# EAGLE design Project (EAGLE 9.6.2)
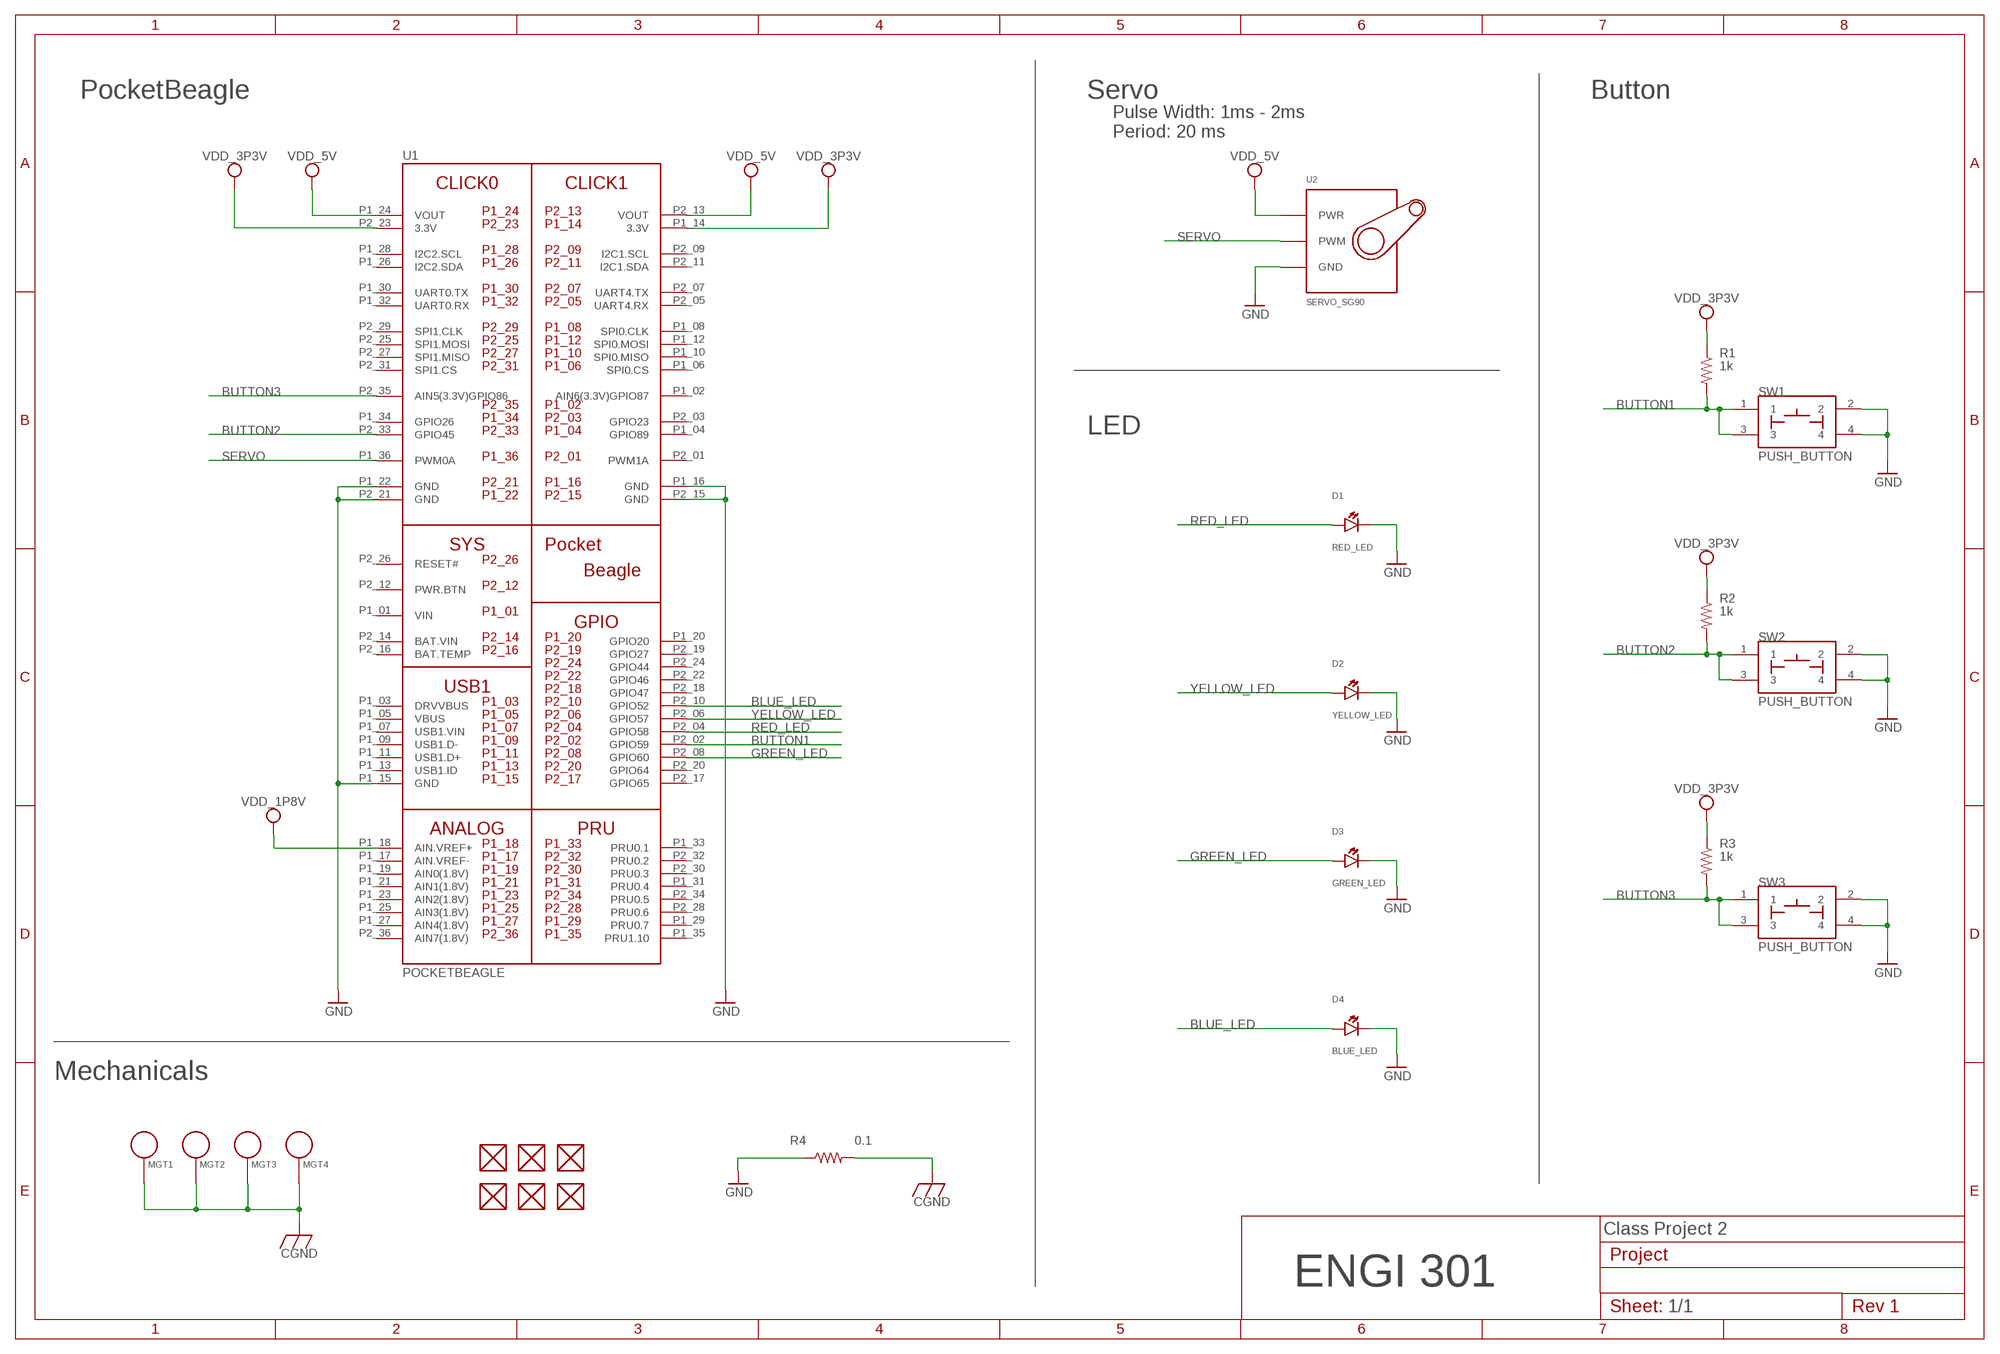
[diagram p0: schematic, sheet 1]

## Parts
D1  RED_LED  LED  [EIA-STD]
D2  YELLOW_LED  LED  [EIA-STD]
D3  GREEN_LED  LED  [EIA-STD]
D4  BLUE_LED  LED  [EIA-STD]
FUD1  FIDUCIAL  [FIDUCIAL_40MIL]
FUD2  FIDUCIAL  [FIDUCIAL_40MIL]
FUD3  FIDUCIAL  [FIDUCIAL_40MIL]
FUD4  FIDUCIAL  [FIDUCIAL_40MIL]
FUD5  FIDUCIAL  [FIDUCIAL_40MIL]
FUD6  FIDUCIAL  [FIDUCIAL_40MIL]
MGT1  MOUNTING_HOLE  [MOUNTING_HOLE]
MGT2  MOUNTING_HOLE  [MOUNTING_HOLE]
MGT3  MOUNTING_HOLE  [MOUNTING_HOLE]
MGT4  MOUNTING_HOLE  [MOUNTING_HOLE]
R1  1k  R_R0603  [R0603]
R2  1k  R_R0603  [R0603]
R3  1k  R_R0603  [R0603]
R4  0.1  R_R0805  [R0805]
SW1  PUSH_BUTTON  [BUTTON_12.5MM]
SW2  PUSH_BUTTON  [BUTTON_12.5MM]
SW3  PUSH_BUTTON  [BUTTON_12.5MM]
U1  POCKETBEAGLE  [POCKETBEAGLE]
U2  SERVO_SG90  [SERVO-X1]

## Nets
BLUE_LED: D4.ANODE U1.P2_10(GPIO52)
BUTTON1: R1.2 SW1.1 SW1.3 U1.P2_02(GPIO59)
BUTTON2: R2.2 SW2.1 SW2.3 U1.P2_33(GPIO45)
BUTTON3: R3.2 SW3.1 SW3.3 U1.P2_35(AIN5(3.3V)GPIO86)
CGND: MGT1.P$1 MGT2.P$1 MGT3.P$1 MGT4.P$1 R4.2
GND: D1.CATHODE D2.CATHODE D3.CATHODE D4.CATHODE R4.1 SW1.2 SW1.4 SW2.2 SW2.4 SW3.2 SW3.4 U1.P1_15(GND) U1.P1_16(GND) U1.P1_22(GND) U1.P2_15(GND) U1.P2_21(GND) U2.GND
GREEN_LED: D3.ANODE U1.P2_08(GPIO60)
RED_LED: D1.ANODE U1.P2_04(GPIO58)
SERVO: U1.P1_36(PWM0A) U2.SIG(PWM)
VDD_1P8V: U1.P1_18(AIN.VREF+)
VDD_3P3V: R1.1 R2.1 R3.1 U1.P1_14(3.3V) U1.P2_23(3.3V)
VDD_5V: U1.P1_24(VOUT) U1.P2_13(VOUT) U2.PWR
YELLOW_LED: D2.ANODE U1.P2_06(GPIO57)
Unconnected: FUD1.P$1 FUD2.P$1 FUD3.P$1 FUD4.P$1 FUD5.P$1 FUD6.P$1 U1.P1_02(AIN6(3.3V)GPIO87) U1.P1_03(DRVVBUS) U1.P1_04(GPIO89) U1.P1_05(VBUS) U1.P1_06(SPI0.CS) U1.P1_07(USB1.VIN) U1.P1_08(SPI0.CLK) U1.P1_09(USB1.D-) U1.P1_10(SPI0.MISO) U1.P1_11(USB1.D+) U1.P1_12(SPI0.MOSI) U1.P1_13(USB1.ID) U1.P1_17(AIN.VREF-) U1.P1_19(AIN0(1.8V)) U1.P1_20(GPIO20) U1.P1_21(AIN1(1.8V)) U1.P1_23(AIN2(1.8V)) U1.P1_25(AIN3(1.8V)) U1.P1_26(I2C2.SDA) U1.P1_27(AIN4(1.8V)) U1.P1_28(I2C2.SCL) U1.P1_29(PRU0.7) U1.P1_30(UART0.TX) U1.P1_31(PRU0.4) U1.P1_32(UART0.RX) U1.P1_33(PRU0.1) U1.P1_34(GPIO26) U1.P1_35(PRU1.10) U1.P2_01(PWM1A) U1.P2_03(GPIO23) U1.P2_05(UART4.RX) U1.P2_07(UART4.TX) U1.P2_09(I2C1.SCL) U1.P2_11(I2C1.SDA) U1.P2_12(PWR.BTN) U1.P2_16(BAT.TEMP) U1.P2_17(GPIO65) U1.P2_18(GPIO47) U1.P2_19(GPIO27) U1.P2_20(GPIO64) U1.P2_22(GPIO46) U1.P2_24(GPIO44) U1.P2_25(SPI1.MOSI) U1.P2_26(RESET#) U1.P2_27(SPI1.MISO) U1.P2_28(PRU0.6) U1.P2_29(SPI1.CLK) U1.P2_30(PRU0.3) U1.P2_31(SPI1.CS) U1.P2_32(PRU0.2) U1.P2_34(PRU0.5) U1.P2_36(AIN7(1.8V))

## Notes on the sheet
- PocketBeagle | Servo | Button
- Pulse Width: 1ms - 2ms
  Period: 20 ms
- LED
- Mechanicals
- Class Project 2
- ENGI 301
- 1/1

## Power pins joined to a net without a drawn wire
BAT.VIN: U1.P2_14(BAT.VIN)
VIN: U1.P1_01(VIN)

## Library data of the parts
D1-D4 = combo_lock:LED: EIA-STD LED, LTST-C191TBKT
FUD1-FUD6 = combo_lock:FIDUCIAL
MGT1-MGT4 = combo_lock:MOUNTING_HOLE: Chassis Mounting Hole w/GND connection ability
R1-R4 = combo_lock:R_: RESISTOR, American symbol
SW1-SW3 = combo_lock:PUSH_BUTTON
U1 = combo_lock:POCKETBEAGLE
U2 = combo_lock:SERVO_SG90

## Board
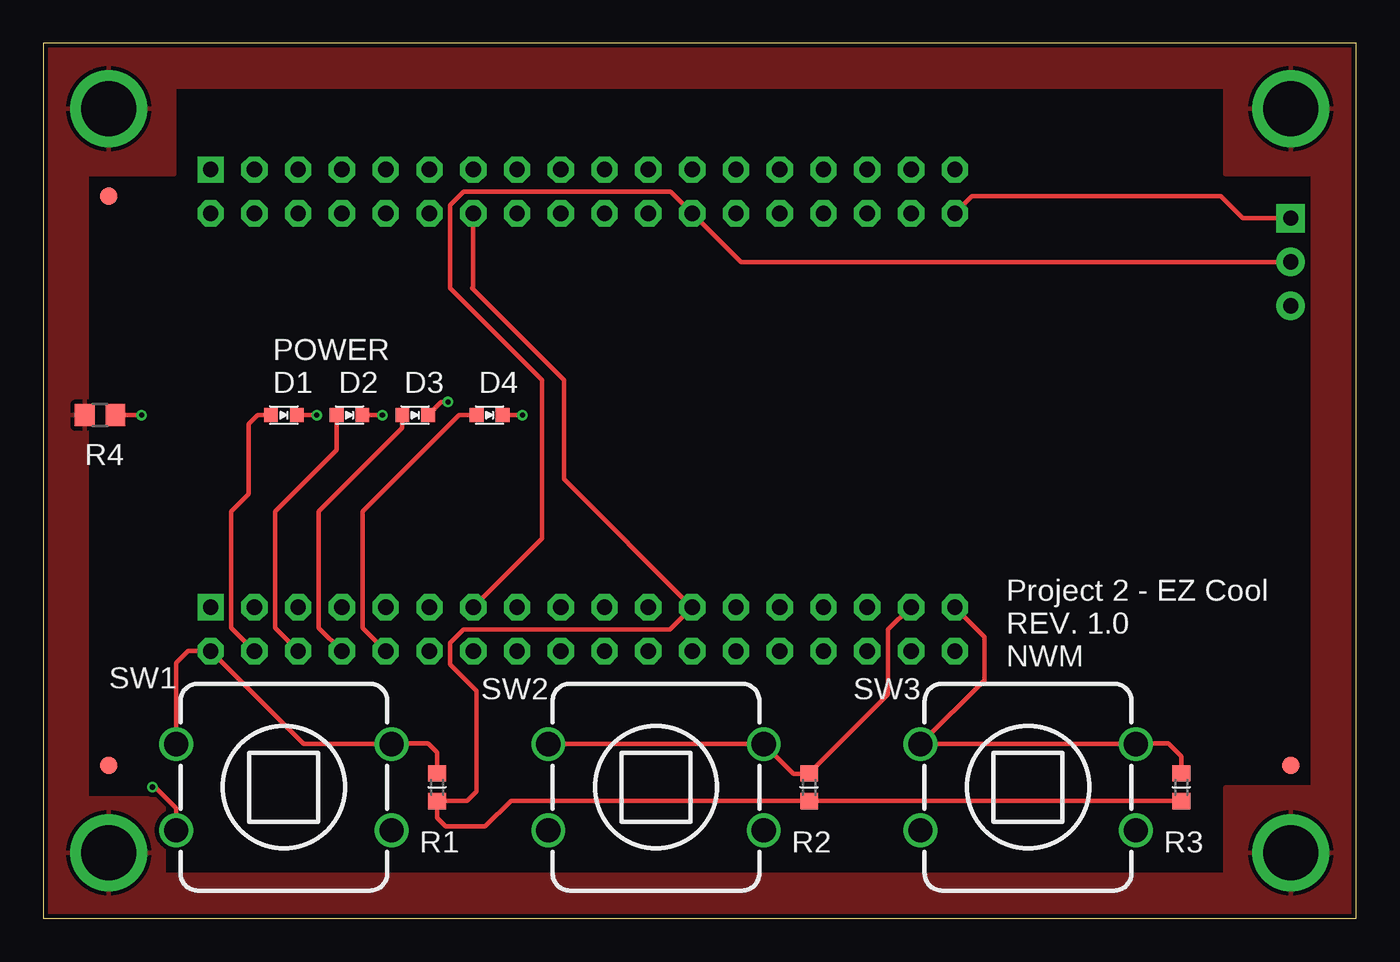
[diagram p1: board, top side]
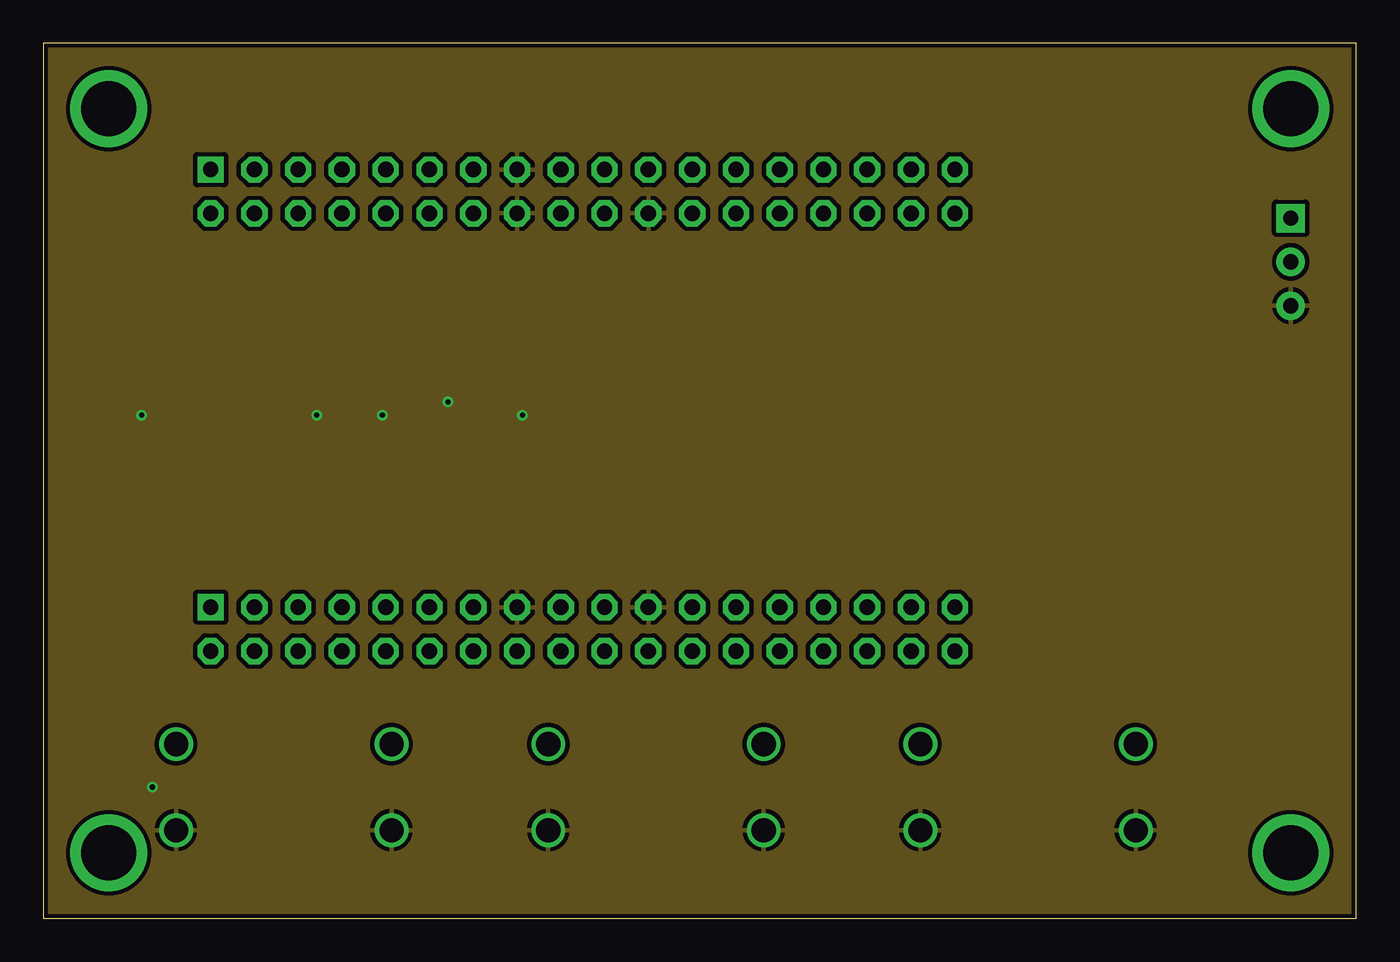
[diagram p2: board, inner layer Route2]
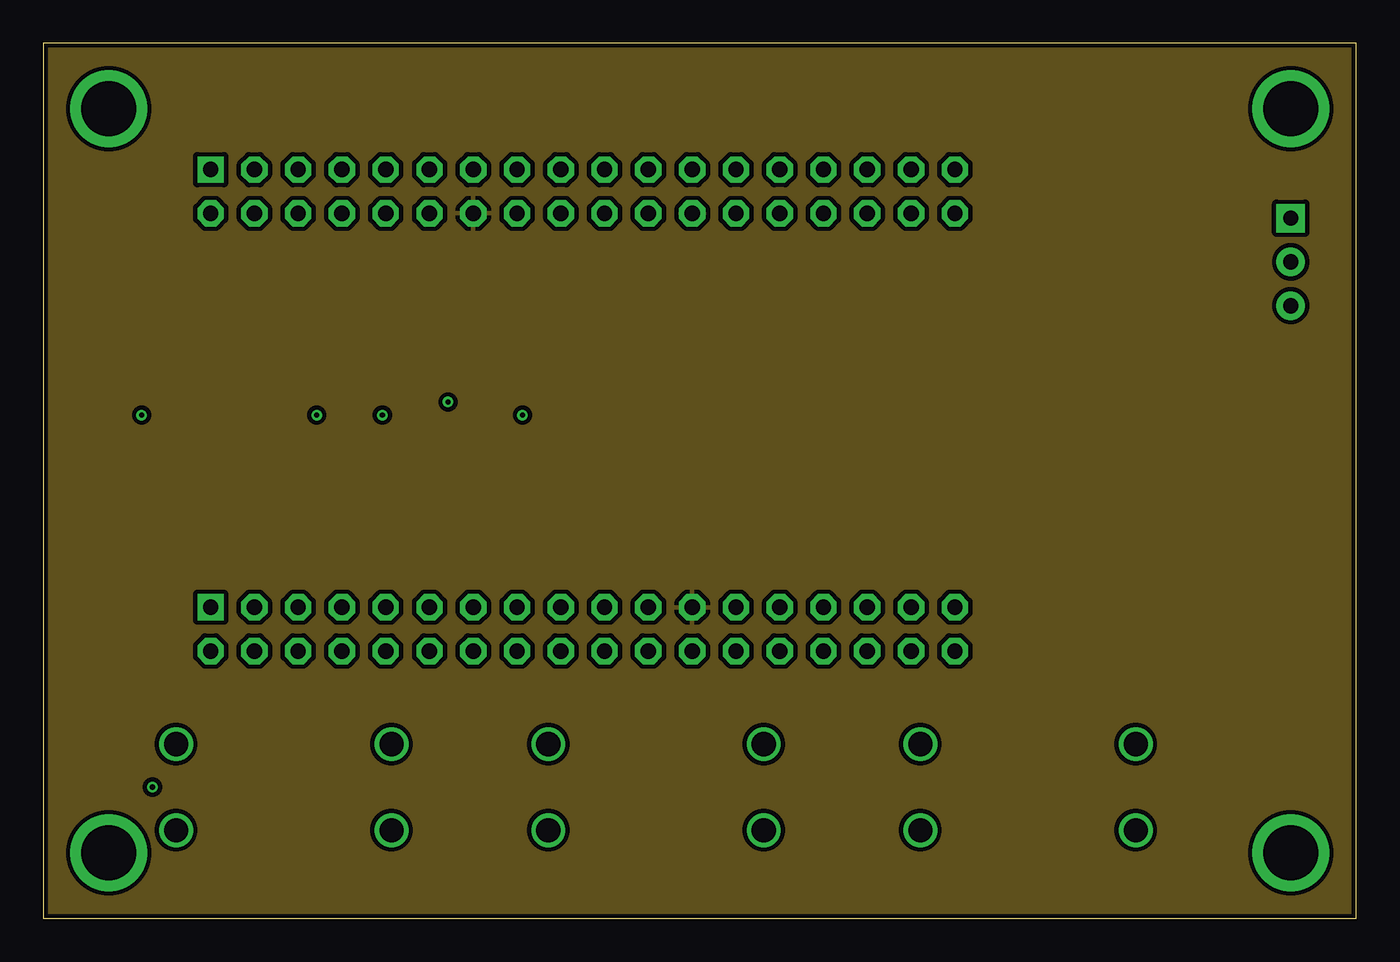
[diagram p3: board, inner layer Route15]
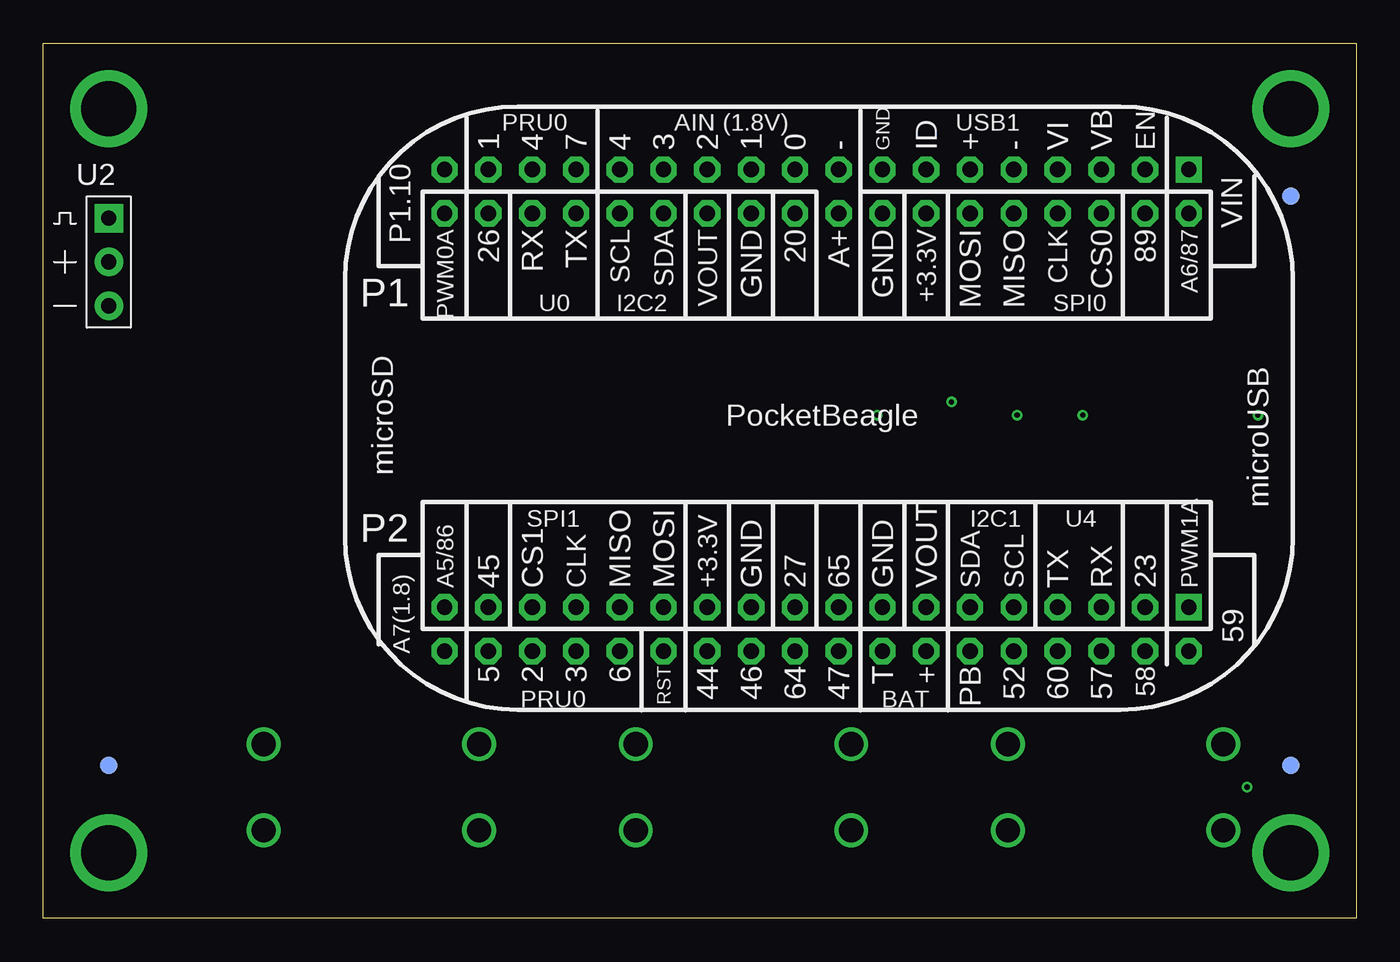
[diagram p4: board, bottom side, seen from below]

Size 76.2 x 50.8 mm. Coordinates in mm from the lower left corner, seen from the top.
Outline: 0,0 76.18,0 76.2,50.8 0,50.8 0,0
Copper layers (1*2*15*16): Top 0.035mm / dielectric 0.23mm / Route2 0.035mm / dielectric 0.93mm / Route15 0.035mm / dielectric 0.23mm / Bottom 0.035mm
Design rules "ENGI301_4lyr": minimum track width 10mil, minimum drill 12mil, track to track 10mil, track to pad 10mil, pad to pad 10mil, via to via 10mil, smd to smd 10mil, copper to edge 10mil, drill to drill 12mil, minimum pad ring 6mil, minimum via ring 6mil, stop-mask expansion 3mil, vias tented up to drill 25mil, thermal gap 10mil

### Footprints (pad centres in the part's own frame; a part is rotated, then mirrored left to right if it is on the bottom)
EIA-STD = smd 0.8 x 0.8: ANODE -0.75,0; CATHODE 0.75,0
FIDUCIAL_40MIL = smd 1.016 x 1.016: P$1 0,0
MOUNTING_HOLE = drill 3.175 pad 4.445: P$1 0,0
R0603 = smd 0.95 x 1.031: 1 -0.8,0; 2 0.8,0
R0805 = smd 1.143 x 1.27: 1 -0.889,0; 2 0.889,0
BUTTON_12.5MM = drill 1.4: 1 -6.25,2.5; 2 -6.25,-2.5; 3 6.25,2.5; 4 6.25,-2.5
POCKETBEAGLE = drill 0.889 pad 1.524 square: P1_01 5.91,3.53; P2_01 5.91,28.93 | drill 0.889 pad 1.524 octagon: P1_02 5.91,6.07; P1_03 8.45,3.53; P1_04 8.45,6.07; P1_05 10.99,3.53; P1_06 10.99,6.07; P1_07 13.53,3.53; P1_08 13.53,6.07; P1_09 16.07,3.53; P1_10 16.07,6.07; P1_11 18.61,3.53; P1_12 18.61,6.07; P1_13 21.15,3.53; P1_14 21.15,6.07; P1_15 23.69,3.53; P1_16 23.69,6.07; P1_17 26.23,3.53; P1_18 26.23,6.07; P1_19 28.77,3.53; P1_20 28.77,6.07; P1_21 31.31,3.53; P1_22 31.31,6.07; P1_23 33.85,3.53; P1_24 33.85,6.07; P1_25 36.39,3.53; P1_26 36.39,6.07; P1_27 38.93,3.53; P1_28 38.93,6.07; P1_29 41.47,3.53; P1_30 41.47,6.07; P1_31 44.01,3.53; P1_32 44.01,6.07; P1_33 46.55,3.53; P1_34 46.55,6.07; P1_35 49.09,3.53; P1_36 49.09,6.07; P2_02 5.91,31.47; P2_03 8.45,28.93; P2_04 8.45,31.47; P2_05 10.99,28.93; P2_06 10.99,31.47; P2_07 13.53,28.93; P2_08 13.53,31.47; P2_09 16.07,28.93; P2_10 16.07,31.47; P2_11 18.61,28.93; P2_12 18.61,31.47; P2_13 21.15,28.93; P2_14 21.15,31.47; P2_15 23.69,28.93; P2_16 23.69,31.47; P2_17 26.23,28.93; P2_18 26.23,31.47; P2_19 28.77,28.93; P2_20 28.77,31.47; P2_21 31.31,28.93; P2_22 31.31,31.47; P2_23 33.85,28.93; P2_24 33.85,31.47; P2_25 36.39,28.93; P2_26 36.39,31.47; P2_27 38.93,28.93; P2_28 38.93,31.47; P2_29 41.47,28.93; P2_30 41.47,31.47; P2_31 44.01,28.93; P2_32 44.01,31.47; P2_33 46.55,28.93; P2_34 46.55,31.47; P2_35 49.09,28.93; P2_36 49.09,31.47
SERVO-X1 = drill 0.889 pad 1.651: GND 0,-2.54; PWR 0,0 | drill 0.889 pad 1.651 square: SIG 0,2.54

### Placement (x,y rotation side)
D1  13.97,29.21 0 top
D2  17.78,29.21 0 top
D3  21.59,29.21 0 top
D4  25.91,29.21 0 top
FUD1  3.81,8.89 0 top
FUD2  3.81,41.91 0 top
FUD3  72.39,8.89 0 top
FUD4  3.81,8.89 0 bottom
FUD5  3.81,41.91 0 bottom
FUD6  72.39,8.89 0 bottom
MGT1  3.81,3.81 0 top
MGT2  72.39,3.81 0 top
MGT3  72.39,46.99 0 top
MGT4  3.81,46.99 0 top
R1  22.86,7.62 90 top
R2  44.45,7.62 90 top
R3  66.04,7.62 90 top
R4  3.3,29.21 180 top
SW1  13.97,7.62 0 top
SW2  35.56,7.62 0 top
SW3  57.15,7.62 0 top
U1  3.81,46.99 180 bottom
U2  72.39,38.1 0 bottom

### Tracks (layer width: path | path; a pad name or v marks a point on that pad's centre or on a via)
BLUE_LED
  Top 0.254: U1.P2_10 18.54,16.86 18.54,23.62 22.99,28.07 24.13,29.21 D4.ANODE
BUTTON1
  Top 0.254: R1.2 22.86,9.65 22.35,10.16 20.26,10.16 SW1.3 15.12,10.12 U1.P2_02 8.41,15.52 7.72,14.83 SW1.1
BUTTON2
  Top 0.254: U1.P2_33 50.32,18.06 49.02,16.76 49.02,12.99 R2.2 44.41,8.38 43.55,8.38 SW2.3 SW2.1
BUTTON3
  Top 0.254: R3.2 66.04,9.4 65.28,10.16 63.44,10.16 SW3.3 SW3.1 54.61,13.83 54.61,16.35 U1.P2_35
CGND
  pour Top: -1.27,25.4 -1.27,-1.27 77.47,-1.27 77.47,25.4 73.66,25.4 73.66,7.62 68.58,7.62 68.58,2.54 6.99,2.54 6.99,6.99 2.54,6.99 2.54,25.4
  pour Top: -1.27,25.4 -1.27,52.07 77.47,52.07 77.47,25.4 73.66,25.4 73.66,43.18 68.58,43.18 68.58,48.26 7.62,48.26 7.62,43.18 2.54,43.18 2.54,25.4
GND  (via drill 0.3 pad 0.61)
  Top 0.254: v6.35,7.62 6.49,7.62 7.72,6.39 SW1.2 | D4.CATHODE v27.81,29.21 | D3.CATHODE 23.1,29.97 v23.5,29.97 | D2.CATHODE v19.68,29.21 | D1.CATHODE v15.88,29.21 | R4.1 v5.71,29.21
  pour Route2: -2.54,-2.54 -2.54,53.34 78.74,53.34 78.74,-2.54
GREEN_LED
  Top 0.254: U1.P2_08 16,16.86 16,23.62 20.84,28.46 D3.ANODE
RED_LED
  Top 0.254: U1.P2_04 10.92,16.86 10.92,23.62 11.94,24.64 11.94,28.7 12.45,29.21 D1.ANODE
SERVO
  Top 0.254: U1.P1_36 53.89,41.91 68.33,41.91 69.6,40.64 U2.SIG
VDD_3P3V
  Top 0.254: R3.1 R2.1 27.14,6.82 25.65,5.33 23.37,5.33 22.86,5.84 R1.1 24.6,6.82 25.15,7.37 25.15,13.21 23.62,14.73 23.62,16 24.38,16.76 36.36,16.76 U1.P2_23 30.23,25.49 30.23,31.24 24.89,36.58 24.96,36.64 U1.P1_14
  pour Route15: -5.08,55.88 81.28,55.88 81.28,-5.08 -5.08,-5.08
VDD_5V
  Top 0.254: U1.P2_13 28.96,22.06 28.96,31.24 23.62,36.58 23.62,41.4 24.38,42.16 36.42,42.16 U1.P1_24 40.48,38.1 U2.PWR
  pour Route15 (rank 6): 36.2,42.55 36.2,36.83 74.3,36.83 74.3,39.37 39.37,39.37 39.37,42.55
YELLOW_LED
  Top 0.254: U1.P2_06 13.46,16.86 13.46,23.62 17.03,27.19 D2.ANODE

### Text on the board
tPlace: POWER | Project 2 - EZ Cool | REV. 1.0 | NWM